# EAGLE schematic apex-lumia (EAGLE 6.1)
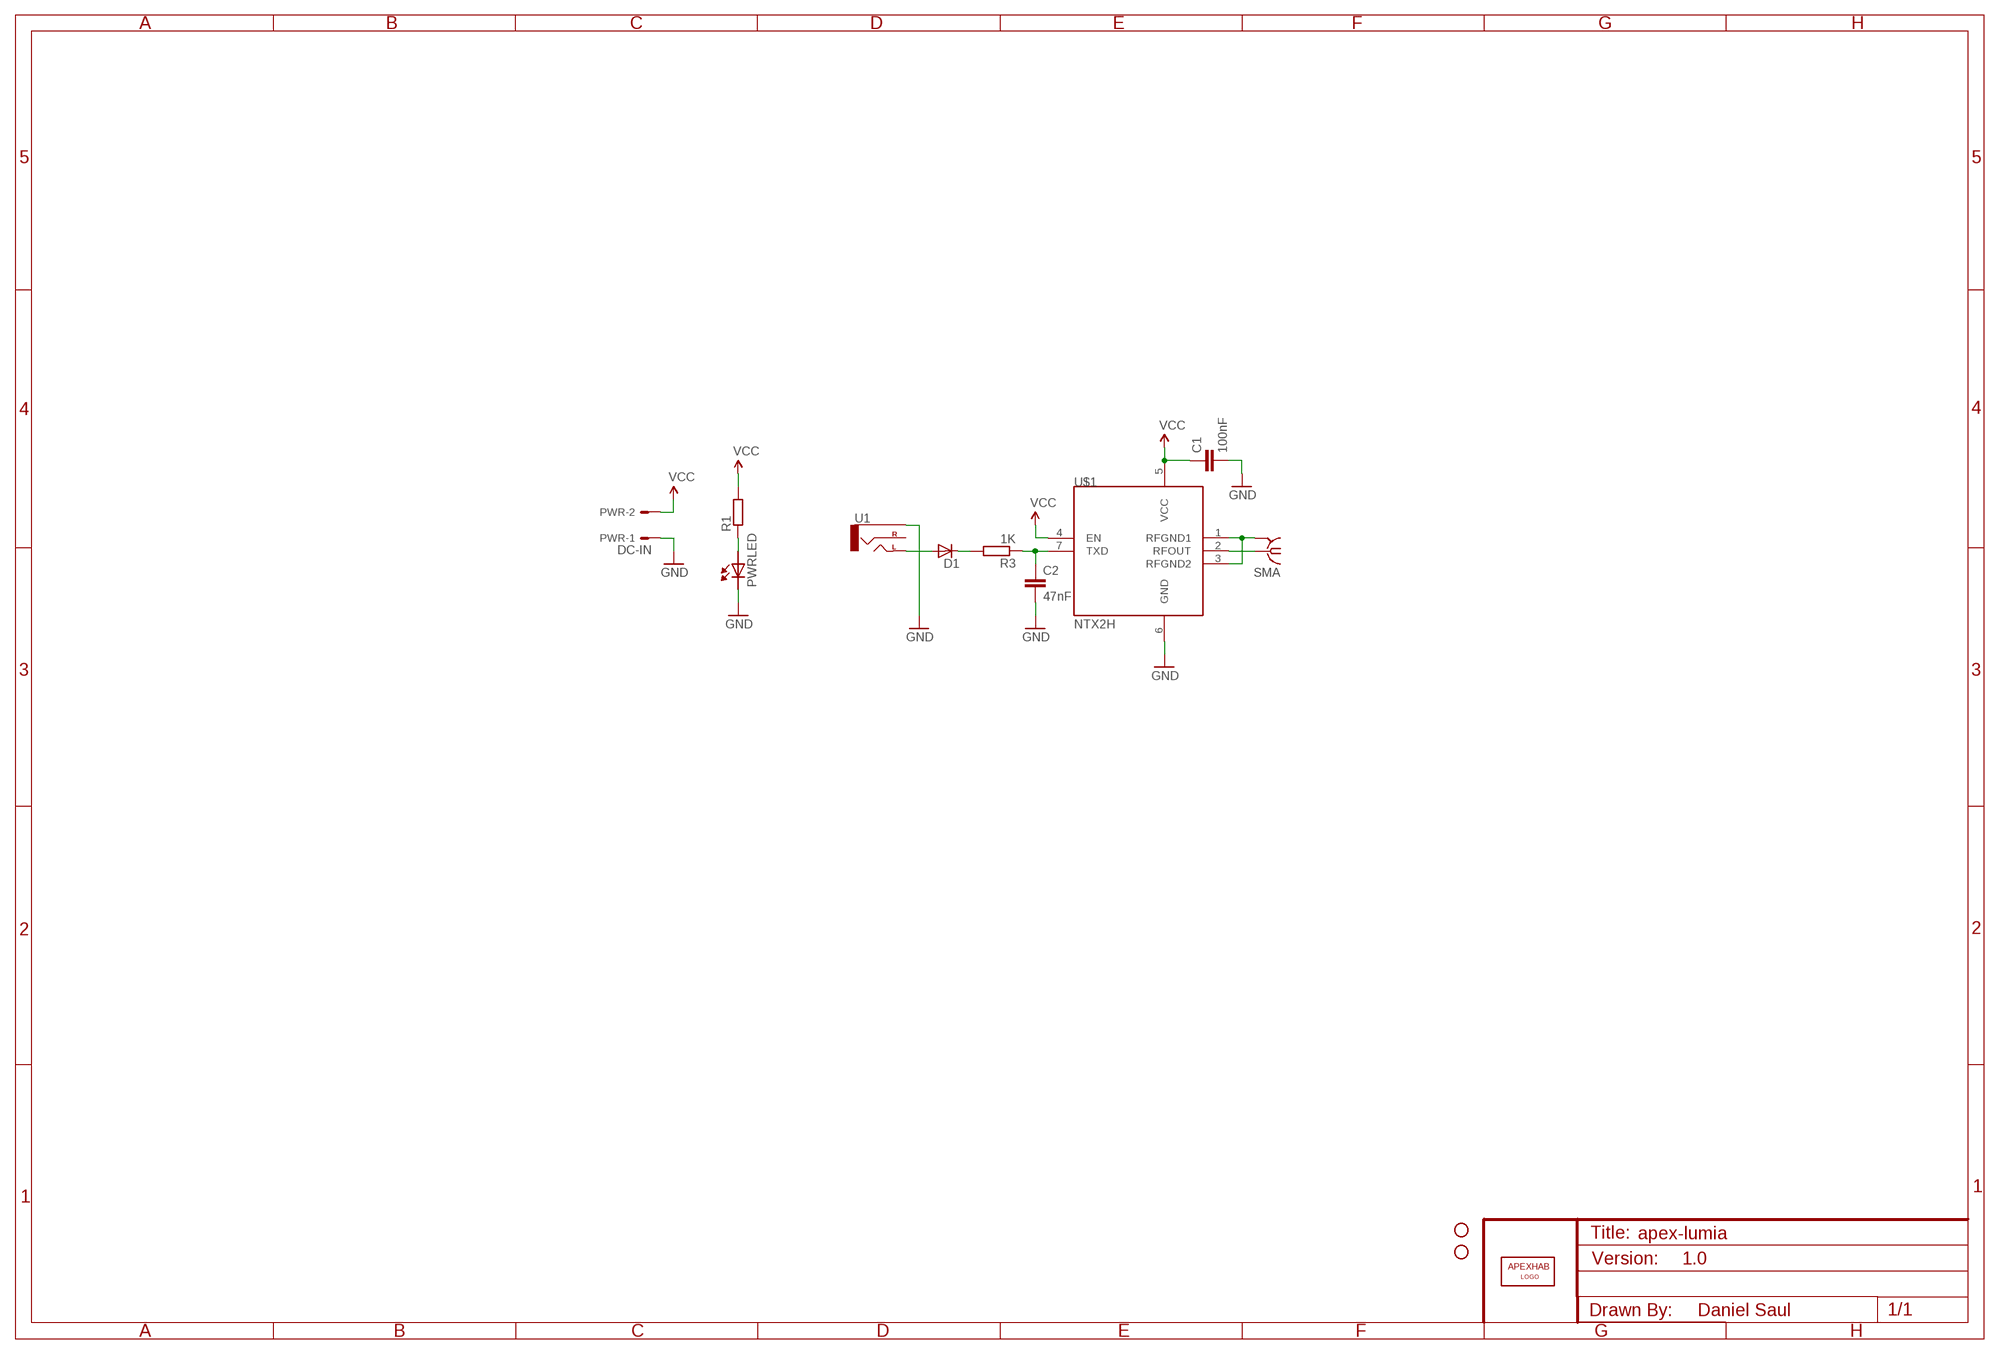
[diagram p0: schematic, sheet 1]

## Parts
C1  100nF  C-EUC0805K  [C0805K]
C2  47nF  C-EUC0805K  [C0805K]
D1  CGRM4001-G  [SOD-123_MINI-SMA]
JP1  APEXHAB-LOGO_APEXHAB-SMALL  [APEXHAB-LOGO-SMALL]
JP2  STAND-OFF  [STAND-OFF]
JP3  STAND-OFF  [STAND-OFF]
PWR  DC-IN  22-05-7028-02  [7395-02]
PWRLED  LED_0603  [CHIPLED_0603]
R1  R-EU_R0805  [R0805]
R3  1K  R-EU_R0805  [R0805]
SMA  SMA-142-0701-801/806  [J502-ND-142-0701-801/806]
U1  AUDIO-JACKPTH  [AUDIO-JACK]
U$1  NTX2H  [NTX2H]

## Nets
GND: C1.2 C2.2 PWR.1 PWRLED.C U1.SLEEVE U$1.6(GND)
N$1: PWRLED.A R1.1
N$3: SMA.1 U$1.2(RFOUT)
N$4: SMA.G@1(GND) U$1.1(RFGND1) U$1.3(RFGND2)
N$5: D1.A U1.TIP(LEFT)
N$6: D1.C R3.2
N$7: C2.1 R3.1 U$1.7(TXD)
VCC: C1.1 PWR.2 R1.2 U$1.4(EN) U$1.5(VCC)
Unconnected: U1.RING(RIGHT)

## Notes on the sheet
- 1.0
- Daniel Saul

## Power pins joined to a net without a drawn wire
GND: SMA.G@2(GND) SMA.G@3(GND) SMA.G@4(GND)

## Library data of the parts
C1 C2 = rcl:C-EU: CAPACITOR, European symbol
D1 = diode:CGRM400*-G: Molded plasitc,JEDEC SOD-123/Mini SMA Source: Comchip CGRM4001-G.pdf
JP1 = apex:APEXHAB-LOGO: ApexHAB PCB Logo This is the standard ApexHAB PCB logo.
JP2 JP3 = apex:STAND-OFF: Stand Off This is the mechanical footprint for a #4 phillips button head screw. Use the keepout ring to avoid running the screw head into surrounding components. SKU : PRT-00447
PWR = apex:22-?-02: CONNECTOR wire to board 2.54 mm (.1 inch) pitch header; OC_FARNELL: 9731601; OC_NEWARK: unknown
PWRLED = apex:LED: SMD LED
R1 R3 = apex:R-EU_: RESISTOR, European symbol
SMA = con-coax:SMA-: SMA 50 Ohm End Launch Jack Receptacle - Round Contact Johnson Components Source: www.johnsoncomponents.com .. J502-ND.pdf; MF: JOHNSON COMPONENTS; MPN: 142-0701-801; OC_FARNELL: 1608592; OC_NEWARK: 90F2624
U1 = apex:AUDIO-JACK: 3.5mm Audio Jack Simple 3.5mm common PCB mount audio jack. SKU: PRT-08032
U$1 = apex:NTX2